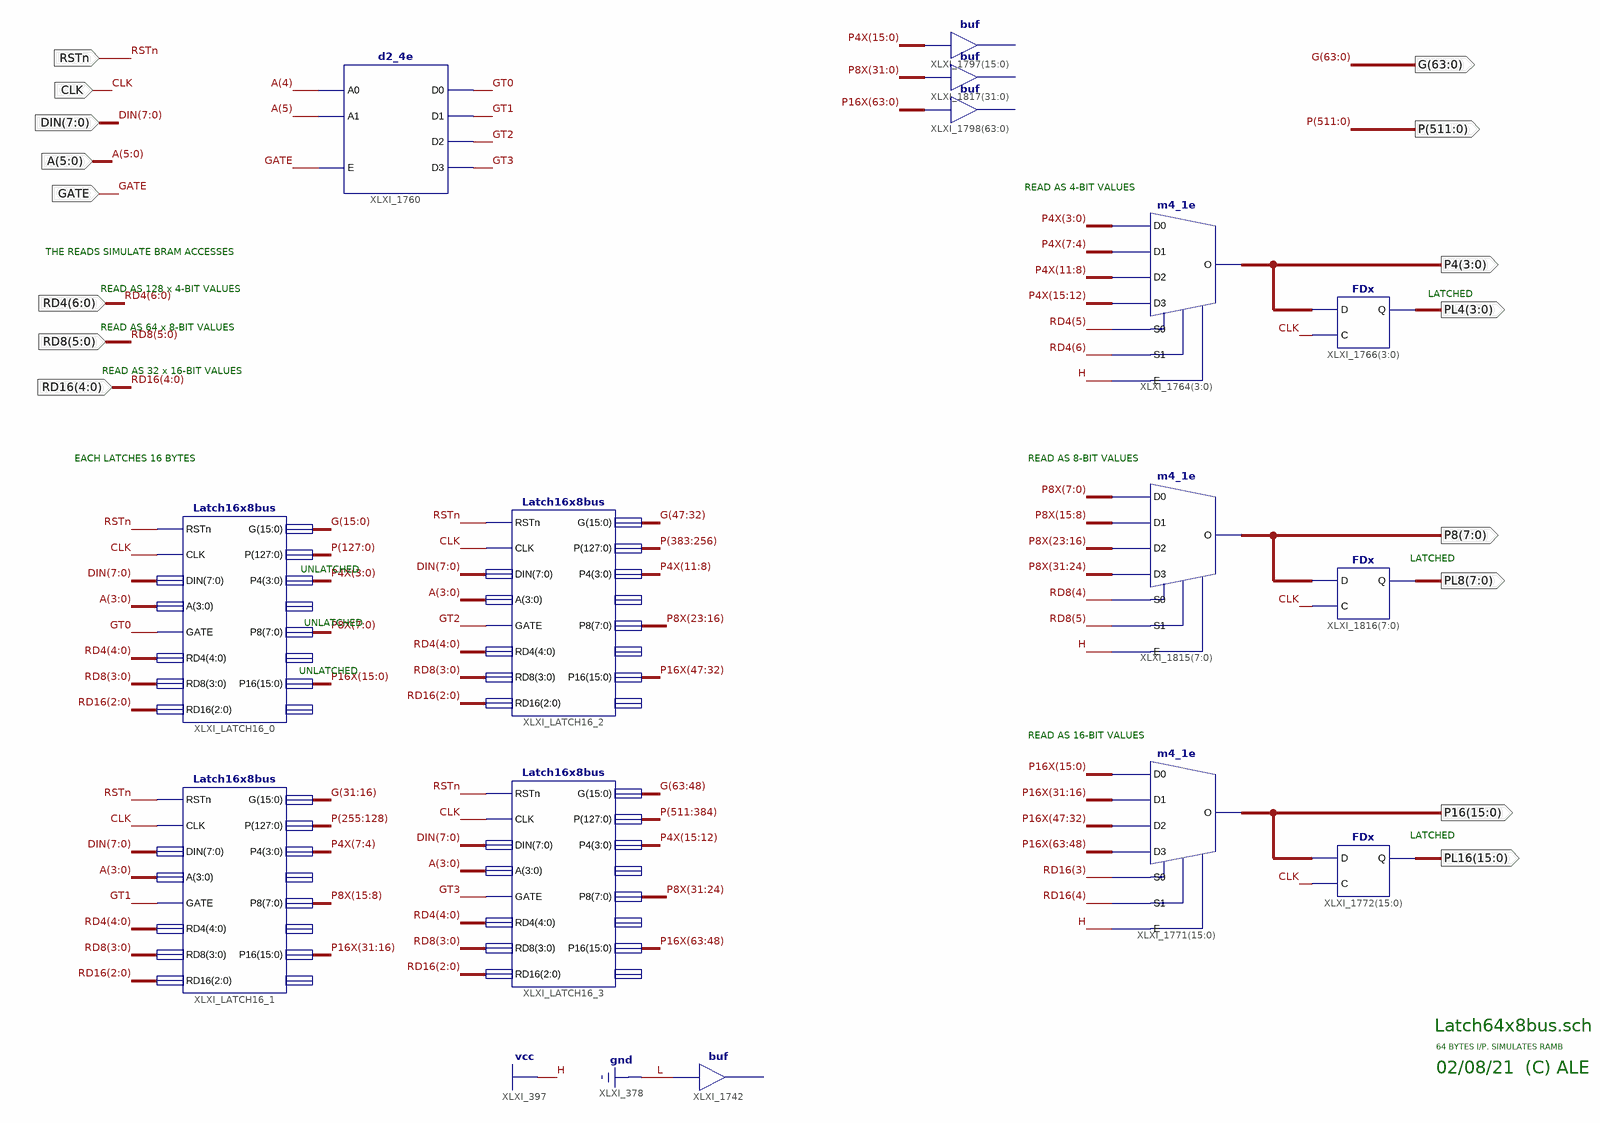
[diagram p0: schematic sheet 1]
// Xilinx ISE schematic Latch64x8bus.sch (spartan3e) as structural Verilog: 15 symbols, 16 ports
module Latch64x8bus (
  input  RSTn,
  input  [7:0] DIN,
  input  CLK,
  input  [5:0] A,
  input  GATE,
  input  [6:0] RD4,
  input  [5:0] RD8,
  input  [4:0] RD16,
  output [511:0] P,
  output [3:0] P4,
  output [63:0] G,
  output [3:0] PL4,
  output [15:0] P16,
  output [15:0] PL16,
  output [7:0] P8,
  output [7:0] PL8
);

  wire GT0, GT1, GT2, GT3;
  wire [15:0] P4X;
  wire [31:0] P8X;
  wire [63:0] P16X;

  // buf XLXI_1742 has open pins: I=1'b0, O=open
  d2_4e XLXI_1760 (.A0(A[4]), .A1(A[5]), .E(GATE), .D0(GT0), .D1(GT1), .D2(GT2), .D3(GT3));
  // buf XLXI_1798[63..0] has open pins: I=P16X, O=open
  m4_1e XLXI_1764[3:0] (
    .D0(P4X[3:0]), .D1(P4X[7:4]), .D2(P4X[11:8]), .D3(P4X[15:12]), .E(1'b1), .S0(RD4[5]), .S1(RD4[6]), .O(P4));
  FDx XLXI_1766[3:0] (.C(CLK), .D(P4), .Q(PL4));
  Latch16x8bus XLXI_LATCH16_1 (
    .A(A[3:0]), .CLK(CLK), .DIN(DIN), .G(G[31:16]), .GATE(GT1), .P(P[255:128]), .P16(P16X[31:16]),
    .P4(P4X[7:4]), .P8(P8X[15:8]), .RD16(RD16[2:0]), .RD4(RD4[4:0]), .RD8(RD8[3:0]), .RSTn(RSTn));  // open: PL16, PL4, PL8
  Latch16x8bus XLXI_LATCH16_3 (
    .A(A[3:0]), .CLK(CLK), .DIN(DIN), .G(G[63:48]), .GATE(GT3), .P(P[511:384]), .P16(P16X[63:48]),
    .P4(P4X[15:12]), .P8(P8X[31:24]), .RD16(RD16[2:0]), .RD4(RD4[4:0]), .RD8(RD8[3:0]), .RSTn(RSTn));  // open: PL16, PL4, PL8
  Latch16x8bus XLXI_LATCH16_0 (
    .A(A[3:0]), .CLK(CLK), .DIN(DIN), .G(G[15:0]), .GATE(GT0), .P(P[127:0]), .P16(P16X[15:0]), .P4(P4X[3:0]),
    .P8(P8X[7:0]), .RD16(RD16[2:0]), .RD4(RD4[4:0]), .RD8(RD8[3:0]), .RSTn(RSTn));  // open: PL16, PL4, PL8
  Latch16x8bus XLXI_LATCH16_2 (
    .A(A[3:0]), .CLK(CLK), .DIN(DIN), .G(G[47:32]), .GATE(GT2), .P(P[383:256]), .P16(P16X[47:32]),
    .P4(P4X[11:8]), .P8(P8X[23:16]), .RD16(RD16[2:0]), .RD4(RD4[4:0]), .RD8(RD8[3:0]), .RSTn(RSTn));  // open: PL16, PL4, PL8
  m4_1e XLXI_1771[15:0] (
    .D0(P16X[15:0]), .D1(P16X[31:16]), .D2(P16X[47:32]), .D3(P16X[63:48]), .E(1'b1), .S0(RD16[3]),
    .S1(RD16[4]), .O(P16));
  FDx XLXI_1772[15:0] (.C(CLK), .D(P16), .Q(PL16));
  m4_1e XLXI_1815[7:0] (
    .D0(P8X[7:0]), .D1(P8X[15:8]), .D2(P8X[23:16]), .D3(P8X[31:24]), .E(1'b1), .S0(RD8[4]), .S1(RD8[5]),
    .O(P8));
  FDx XLXI_1816[7:0] (.C(CLK), .D(P8), .Q(PL8));
  // buf XLXI_1797[15..0] has open pins: I=P4X, O=open
  // buf XLXI_1817[31..0] has open pins: I=P8X, O=open

  // Notes on the sheet:
  //   READ AS 4-BIT VALUES
  //   THE READS SIMULATE BRAM ACCESSES
  //   READ AS 128 x 4-BIT VALUES
  //   LATCHED
  //   READ AS 64 x 8-BIT VALUES
  //   READ AS 32 x 16-BIT VALUES
  //   EACH LATCHES 16 BYTES
  //   READ AS 8-BIT VALUES
  //   LATCHED
  //   UNLATCHED
  //   UNLATCHED
  //   UNLATCHED
  //   READ AS 16-BIT VALUES
  //   LATCHED
  //   Latch64x8bus.sch
  //   64 BYTES I/P. SIMULATES RAMB
  //   02/08/21  (C) ALE
endmodule
